# EAGLE design LabDuino (EAGLE 7.2.0)
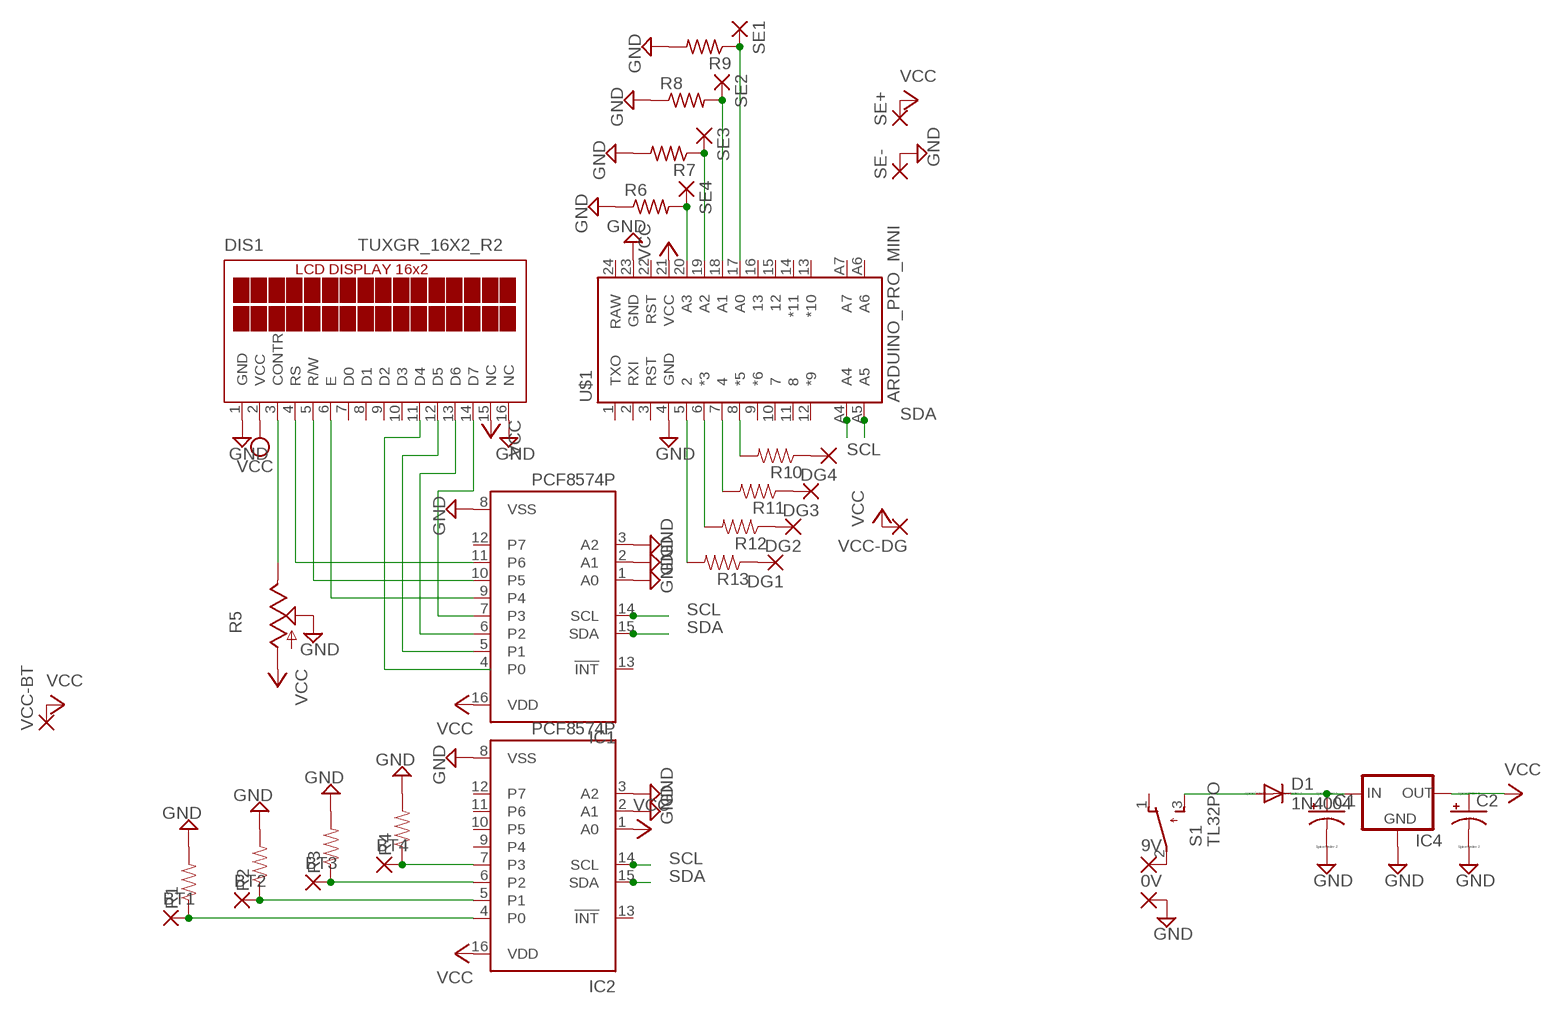
[diagram p0: schematic, sheet 1]

## Parts
0V  2,54/1,1  [2,54/1,1]
9V  2,54/1,1  [2,54/1,1]
BT1  1,6/0,9  [1,6/0,9]
BT2  1,6/0,9  [1,6/0,9]
BT3  1,6/0,9  [1,6/0,9]
BT4  1,6/0,9  [1,6/0,9]
C1  CPOL-USE2-4  [E2-4]
C2  CPOL-USE2-4  [E2-4]
D1  1N4004  [DO41-10]
DG1  1,6/0,9  [1,6/0,9]
DG2  1,6/0,9  [1,6/0,9]
DG3  1,6/0,9  [1,6/0,9]
DG4  1,6/0,9  [1,6/0,9]
DIS1  TUXGR_16X2_R2  [TUXGR_16X2_R2]
IC1  PCF8574P  [DIL16]
IC2  PCF8574P  [DIL16]
IC4  V_REG_78XX-TO-220  [TO-220-ALT]
R1  RESISTORPTH-1/6W  [1/6W-RES]
R2  RESISTORPTH-1/6W  [1/6W-RES]
R3  RESISTORPTH-1/6W  [1/6W-RES]
R4  RESISTORPTH-1/6W  [1/6W-RES]
R5  TRIM_US-B25P  [B25P]
R6  R-US_0204/7  [0204/7]
R7  R-US_0204/7  [0204/7]
R8  R-US_0204/7  [0204/7]
R9  R-US_0204/7  [0204/7]
R10  RESISTORPTH-1/6W  [1/6W-RES]
R11  RESISTORPTH-1/6W  [1/6W-RES]
R12  RESISTORPTH-1/6W  [1/6W-RES]
R13  RESISTORPTH-1/6W  [1/6W-RES]
S1  TL32PO  [TL3XPO]
SE1  1,6/0,9  [1,6/0,9]
SE2  1,6/0,9  [1,6/0,9]
SE3  1,6/0,9  [1,6/0,9]
SE4  1,6/0,9  [1,6/0,9]
SE+  1,6/0,9  [1,6/0,9]
SE-  1,6/0,9  [1,6/0,9]
U$1  ARDUINO_PRO_MINI  [ARDUINO_PRO_MINI]
VCC-BT  1,6/0,9  [1,6/0,9]
VCC-DG  1,6/0,9  [1,6/0,9]

## Nets
10K: BT2.1(P) IC2.5(P1) R2.1
GND: 0V.1(P) C1.- C2.- DIS1.1(GND) DIS1.16(NC) IC1.1(A0) IC1.2(A1) IC1.3(A2) IC1.8(VSS) IC2.2(A1) IC2.3(A2) IC2.8(VSS) IC4.GND R1.2 R2.2 R3.2 R4.2 R5.S R6.1 R7.2 R8.1 R9.2 SE-.1(P) U$1.4(GND) U$1.23(GND)
N$1: R6.2 SE4.1(P) U$1.20(A3)
N$2: BT1.1(P) IC2.4(P0) R1.1
N$3: 9V.1(P) S1.2(P)
N$4: BT3.1(P) IC2.6(P2) R3.1
N$5: BT4.1(P) IC2.7(P3) R4.1
N$6: R7.1 SE3.1(P) U$1.19(A2)
N$7: DIS1.4(RS) IC1.11(P6)
N$8: DIS1.5(R/W) IC1.10(P5)
N$9: DIS1.6(E) IC1.9(P4)
N$10: DIS1.14(D7) IC1.7(P3)
N$11: DIS1.13(D6) IC1.6(P2)
N$12: DIS1.12(D5) IC1.5(P1)
N$13: DIS1.11(D4)
N$14: DIS1.3(CONTR) R5.E
N$15: D1.A S1.3(S)
N$16: C1.+ D1.C IC4.IN
N$17: R8.2 SE2.1(P) U$1.18(A1)
N$18: R9.1 SE1.1(P) U$1.17(A0)
N$19: R13.2 U$1.5
N$20: R12.2 U$1.6(*3)
N$21: R11.2 U$1.7
N$22: R10.2 U$1.8(*5)
N$23: DG1.1(P) R13.1
N$24: DG2.1(P) R12.1
N$25: DG3.1(P) R11.1
N$26: DG4.1(P) R10.1
SCL: IC1.14(SCL) IC2.14(SCL) U$1.A4
SDA: IC1.15(SDA) IC2.15(SDA) U$1.A5
VCC: C2.+ DIS1.2(VCC) DIS1.15(NC) IC1.16(VDD) IC2.1(A0) IC2.16(VDD) IC4.OUT R5.A SE+.1(P) U$1.21(VCC) VCC-BT.1(P) VCC-DG.1(P)
Unconnected: DIS1.7(D0) DIS1.8(D1) DIS1.9(D2) DIS1.10(D3) IC1.4(P0) IC1.12(P7) IC1.13(!INT) IC2.9(P4) IC2.10(P5) IC2.11(P6) IC2.12(P7) IC2.13(!INT) S1.1(O) U$1.1(TXO) U$1.2(RXI) U$1.3(RST) U$1.9(*6) U$1.10 U$1.11 U$1.12(*9) U$1.13(*10) U$1.14(*11) U$1.15 U$1.16 U$1.22(RST) U$1.24(RAW) U$1.A6 U$1.A7

## Library data of the parts
0V 9V = wirepad:2,54/1,1: THROUGH-HOLE PAD
BT1-BT4 DG1-DG4 SE1-SE4 SE+ SE- VCC-BT VCC-DG = wirepad:1,6/0,9: THROUGH-HOLE PAD
C1 C2 = resistor:CPOL-US: POLARIZED CAPACITOR, American symbol
D1 = diode:1N4004: DIODE general purpose rectifier, 1 A
DIS1 = display-lcd:TUXGR_16X2_R2: Tuxgraphics LCD display 16x2 characters reflective, without background light Source: tuxgr_12x2_r2.pdf; OC_FARNELL: unknown; OC_NEWARK: unknown
IC1 IC2 = micro-philips:PCF8574: I2C-Bus Remote 8-bit I/O expander http://www.semiconductors.philips.com/acrobat_download/datasheets/PCF8574_4.pdf; MPN: PCF8574PN; OC_FARNELL: 204020; OC_NEWARK: 11N8515
IC4 = SparkFun-PowerIC:V_REG_78XX: Voltage Regulator Standard 78xx regulator. IGO (Input Ground Output). Spark Fun Electronics SKU : COM-00107
R1-R4 R10-R13 = SparkFun-Resistors:RESISTOR: Resistor Basic schematic elements and footprints for 0603, 1206, and PTH resistors.
R5 = pot:TRIM_US-: POTENTIOMETER
R6-R9 = resistor:R-US_: RESISTOR, American symbol
S1 = switch:TL32PO: TINY SWITCH ON - MOM Source: http://www2.produktinfo.conrad.com/datenblaetter/700000-724999/705152-da-01-de-Subminiaturschalter_TL_36YO.pdf
U$1 = SparkFun-Boards:ARDUINO_PRO_MINI

## Net classes
0 default: width 1.5 mm, drill 0.254 mm, clearance 2 mm

## Board
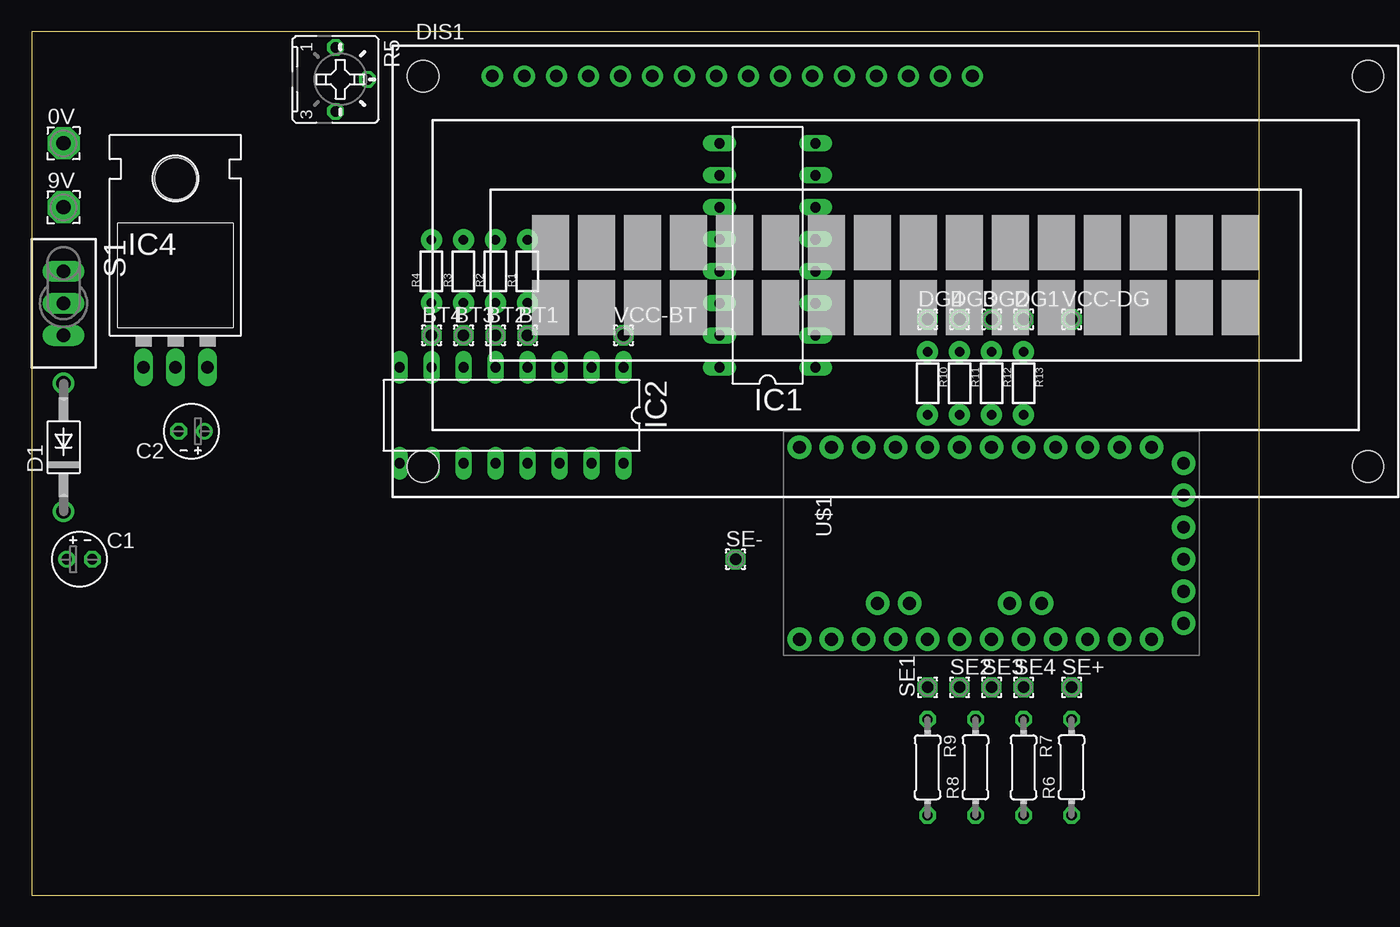
[diagram p1: board, top side]
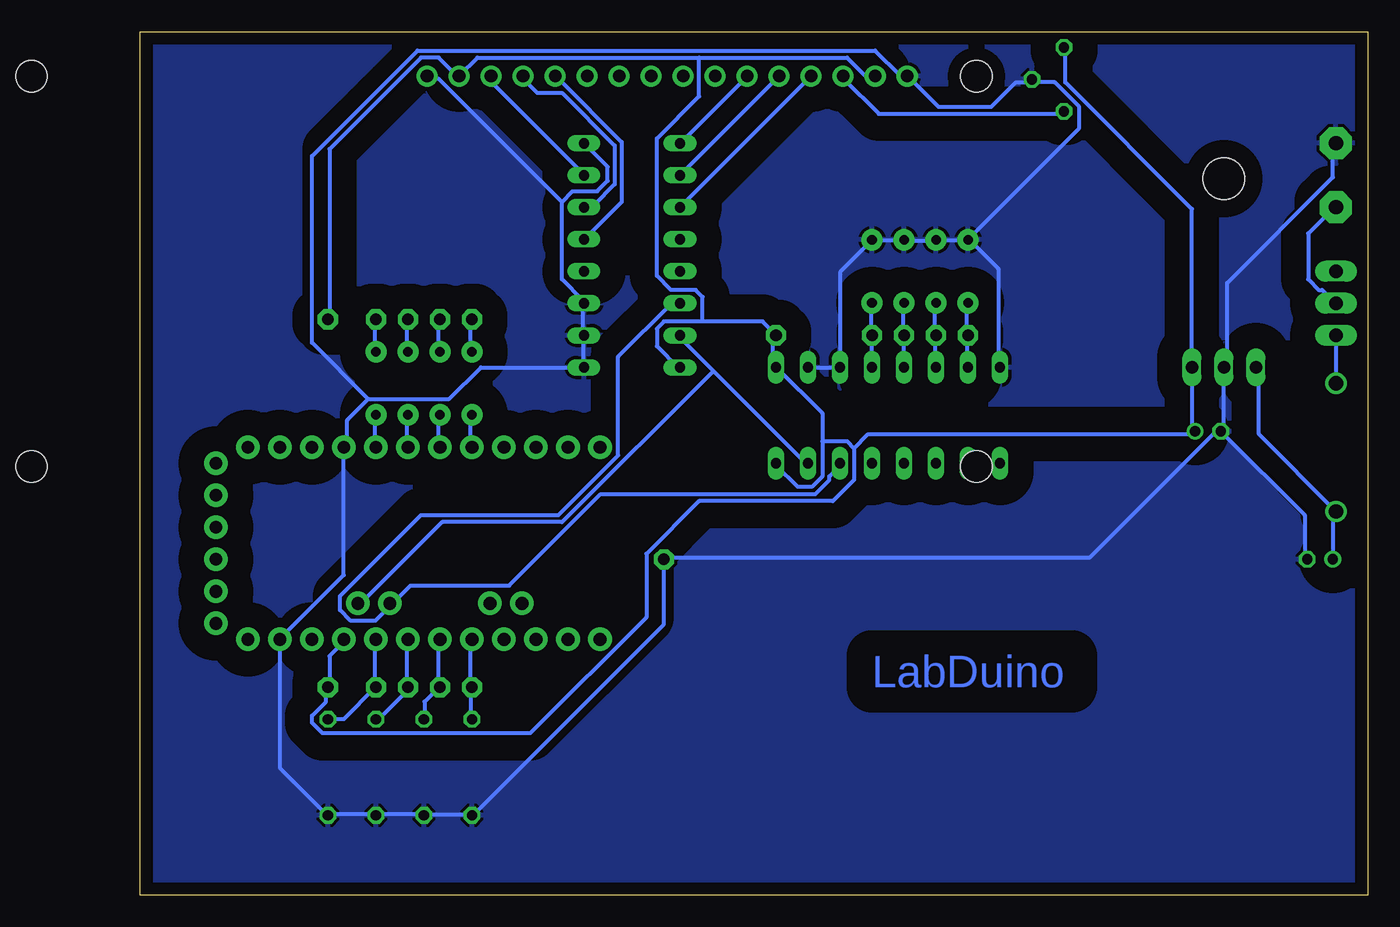
[diagram p2: board, bottom side, seen from below]

Size 97.46 x 68.57 mm. Coordinates in mm from the lower left corner, seen from the top.
Outline: 0,0 97.46,0 97.46,68.57 0,68.57 0,0
Copper layers (1*16): Top 0.035mm / dielectric 1.5mm / Bottom 0.035mm
Design rules "default": minimum track width 10mil, minimum drill 24mil, track to track 8mil, track to pad 8mil, pad to pad 8mil, via to via 8mil, smd to smd 8mil, copper to edge 40mil, drill to drill 8mil, minimum pad ring 10mil, minimum via ring 8mil, stop-mask expansion 4mil, vias tented up to drill 0mil, thermal gap 10mil

### Footprints (pad centres in the part's own frame; a part is rotated, then mirrored left to right if it is on the bottom)
2,54/1,1 = drill 1.118 pad 2.54 octagon: 1 0,0
1,6/0,9 = drill 0.914 pad 1.6 octagon: 1 0,0
E2-4 = drill 0.813 pad 1.27: + -1.016,0 | drill 0.813 pad 1.27 octagon: - 1.016,0
DO41-10 = drill 1.118: A 5.08,0; C -5.08,0
TUXGR_16X2_R2 = drill 1 pad 1.676: 1 -32,15.5; 2 -29.46,15.5; 3 -26.92,15.5; 4 -24.38,15.5; 5 -21.84,15.5; 6 -19.3,15.5; 7 -16.76,15.5; 8 -14.22,15.5; 9 -11.68,15.5; 10 -9.14,15.5; 11 -6.6,15.5; 12 -4.06,15.5; 13 -1.52,15.5; 14 1.02,15.5; 15 3.56,15.5; 16 6.1,15.5 | hole 2.5: -37.5,-15.5; 37.5,-15.5; -37.5,15.5; 37.5,15.5
DIL16 = drill 0.813 long: 1 -8.89,-3.81; 2 -6.35,-3.81; 3 -3.81,-3.81; 4 -1.27,-3.81; 5 1.27,-3.81; 6 3.81,-3.81; 7 6.35,-3.81; 8 8.89,-3.81; 9 8.89,3.81; 10 6.35,3.81; 11 3.81,3.81; 12 1.27,3.81; 13 -1.27,3.81; 14 -3.81,3.81; 15 -6.35,3.81; 16 -8.89,3.81
TO-220-ALT = drill 1.016 long: GND 0,-3.81; IN -2.54,-3.81; OUT 2.54,-3.81 | hole 3.302: 0,11.176
1/6W-RES = drill 0.762 pad 1.676: 1 -2.5,0; 2 2.5,0
B25P = drill 0.813 octagon: A -2.54,0; E 2.54,0; S 0,2.54
0204/7 = drill 0.813 octagon: 1 -3.81,0; 2 3.81,0
TL3XPO = drill 1.1 pad 1.422 long: 1 -2.54,0; 2 0,0; 3 2.54,0
ARDUINO_PRO_MINI = drill 1.016 pad 1.88: 1 -7.62,12.7; 2 -7.62,10.16; 3 -7.62,7.62; 4 -7.62,5.08; 5 -7.62,2.54; 6 -7.62,0; 7 -7.62,-2.54; 8 -7.62,-5.08; 9 -7.62,-7.62; 10 -7.62,-10.16; 11 -7.62,-12.7; 12 -7.62,-15.24; 13 7.62,-15.24; 14 7.62,-12.7; 15 7.62,-10.16; 16 7.62,-7.62; 17 7.62,-5.08; 18 7.62,-2.54; 19 7.62,0; 20 7.62,2.54; 21 7.62,5.08; 22 7.62,7.62; 23 7.62,10.16; 24 7.62,12.7; A4 4.763,1.429; A5 4.763,3.969; A6 4.763,-9.049; A7 4.763,-6.509; BLK -6.35,15.24; GND -3.81,15.24; GRN 6.35,15.24; RXI 1.27,15.24; TXO 3.81,15.24; VCC -1.27,15.24

### Placement (x,y rotation side)
0V  2.54,59.69 0 top
9V  2.54,54.61 0 top
BT1  39.37,44.45 0 top
BT2  36.83,44.45 0 top
BT3  34.29,44.45 0 top
BT4  31.75,44.45 0 top
C1  3.81,26.67 0 top
C2  12.7,36.83 180 top
D1  2.54,35.56 90 top
DG1  78.74,45.72 0 top
DG2  76.2,45.72 0 top
DG3  73.66,45.72 0 top
DG4  71.12,45.72 0 top
DIS1  68.58,49.53 0 top
IC1  58.42,50.8 90 top
IC2  38.1,38.1 180 top
IC4  11.43,45.72 0 top
R1  39.37,49.53 90 top
R2  36.83,49.53 90 top
R3  34.29,49.53 90 top
R4  31.75,49.53 90 top
R5  24.13,64.77 270 top
R6  82.55,10.16 90 top
R7  78.74,10.16 270 top
R8  74.93,10.16 90 top
R9  71.12,10.16 270 top
R10  71.12,40.64 270 top
R11  73.66,40.64 270 top
R12  76.2,40.64 270 top
R13  78.74,40.64 270 top
S1  2.54,46.99 270 top
SE1  71.12,16.51 90 top
SE2  73.66,16.51 0 top
SE3  76.2,16.51 0 top
SE4  78.74,16.51 0 top
SE+  82.55,16.51 0 top
SE-  55.88,26.67 0 top
U$1  76.2,27.94 270 top
VCC-BT  46.99,44.45 0 top
VCC-DG  82.55,45.72 0 top

### Tracks (layer width: path | path; a pad name or v marks a point on that pad's centre or on a via)
10K
  Bottom 0.305: IC2.5 36.88,41.91 36.88,44.42 BT2.1 36.88,44.7 36.88,46.94 R2.1
GND
  Bottom 0.305: C2.- 5.03,30.18 5.03,26.82 C1.- | C2.- 11.46,36.88 11.46,41.91 IC4.GND 11.18,41.91 11.18,48.62 2.79,57 2.79,59.51 0V.1 | IC2.2 IC2.3 41.91,49.45 39.4,51.97 R1.2 39.12,51.97 36.88,51.97 R2.2 36.6,51.97 34.37,51.97 R3.2 34.09,51.97 31.85,51.97 R4.2 | IC2.8 29.34,41.91 29.34,49.73 31.57,51.97 R4.2 | R4.2 31.57,52.25 22.91,60.91 22.91,62.59 24.87,64.54 26.54,64.54 R5.S 26.82,64.54 27.94,64.54 29.9,62.59 34.09,62.59 36.32,64.82 DIS1.1 36.6,65.1 37.16,65.1 39.12,67.06 75.44,67.06 83.82,58.67 83.82,43.87 79.35,39.4 | 62.31,41.91 62.31,44.42 IC1.2 62.31,44.7 62.31,46.94 IC1.3 62.31,47.22 63.98,48.9 63.98,55.04 | 63.98,55.04 63.14,55.88 61.19,55.88 60.35,56.72 60.35,57.84 62.03,59.51 IC1.8 | 63.98,55.04 73.76,64.82 74.6,64.82 DIS1.16 | 62.31,41.91 70.41,41.91 72.92,39.4 79.35,39.4 | 79.35,39.4 81.03,37.72 81.03,35.76 U$1.4 81.31,35.48 81.31,25.43 86.33,20.4 U$1.23 86.33,20.12 86.33,10.06 82.7,6.43 R6.1 82.42,6.43 78.79,6.43 R7.2 78.51,6.43 75.16,6.43 R8.1 74.88,6.43 71.25,6.43 R9.2 70.97,6.43 55.88,21.51 SE-.1 55.88,26.82 22.07,26.82 12.29,36.6 11.73,36.6 C2.- | 62.31,41.91 IC1.1
  pour Bottom: -1.27,69.85 -1.27,-1.27 99.06,-1.27 99.06,69.85
N$1
  Bottom 0.305: R6.2 81.31,13.97 78.79,16.48 SE4.1 78.79,16.76 78.79,20.12 U$1.20
N$2
  Bottom 0.305: IC2.4 39.4,41.91 39.4,44.42 BT1.1 39.4,44.7 39.4,46.94 R1.1
N$3
  Bottom 0.305: S1.2 2.79,47.22 3.63,48.06 3.91,48.06 4.75,48.9 4.75,52.53 2.79,54.48 9V.1
N$4
  Bottom 0.305: IC2.6 34.37,41.91 34.37,44.42 BT3.1 34.37,44.7 34.37,46.94 R3.1
N$5
  Bottom 0.305: IC2.7 31.85,41.91 31.85,44.42 BT4.1 31.85,44.7 31.85,46.94 R4.1
N$6
  Bottom 0.305: R7.1 78.51,13.97 76,16.48 SE3.1 76.28,16.76 76.28,20.12 U$1.19
N$7
  Bottom 0.305: IC1.11 54.48,54.76 44.42,64.82 DIS1.4
N$8
  Bottom 0.305: IC1.10 46.94,64.82 DIS1.5
N$9
  Bottom 0.305: IC1.9 54.48,59.79 49.45,64.82 DIS1.6
N$10
  Bottom 0.305: IC1.7 62.31,57.28 69.85,64.82 DIS1.14
N$11
  Bottom 0.305: IC1.6 62.03,54.76 61.47,54.76 59.79,56.44 59.79,59.51 63.98,63.7 65.94,63.7 67.06,64.82 DIS1.13
N$12
  Bottom 0.305: IC1.5 62.03,52.25 59.23,55.04 59.23,59.79 64.26,64.82 DIS1.12
N$14
  Bottom 0.305: R5.E 24.31,62.03 38.84,62.03 41.63,64.82 DIS1.3
N$15
  Bottom 0.305: S1.3 2.52,44.42 2.52,40.79 D1.A
N$16
  Bottom 0.305: C1.+ 2.79,30.45 D1.C 8.66,36.6 8.66,41.91 IC4.IN
N$17
  Bottom 0.305: R8.2 74.88,13.97 74.88,15.37 73.76,16.48 SE2.1 73.76,16.76 73.76,20.12 U$1.18
N$18
  Bottom 0.305: R9.1 71.25,13.97 71.25,16.48 SE1.1 71.25,16.76 71.25,20.12 U$1.17
N$19
  Bottom 0.305: R13.2 78.79,38 78.79,35.76 U$1.5
N$20
  Bottom 0.305: R12.2 76.28,38 76.28,35.76 U$1.6
N$21
  Bottom 0.305: R11.2 73.76,38 73.76,35.76 U$1.7
N$22
  Bottom 0.305: R10.2 71.25,38 71.25,35.76 U$1.8
N$23
  Bottom 0.305: DG1.1 78.79,45.54 78.79,43.31 R13.1
N$24
  Bottom 0.305: DG2.1 76.28,45.54 76.28,43.31 R12.1
N$25
  Bottom 0.305: DG3.1 73.76,45.54 73.76,43.31 R11.1
N$26
  Bottom 0.305: DG4.1 71.25,45.54 71.25,43.31 R10.1
SCL
  Bottom 0.305: IC2.14 41.91,34.09 42.75,33.25 42.75,32.97 43.87,31.85 60.91,31.85 68.17,24.59 76,24.59 77.39,23.19 U$1.A4 77.67,22.91 78.79,21.79 80.75,21.79 81.58,22.63 81.58,23.75 75.16,30.18 64.26,30.18 59.51,34.92 59.51,42.75 55.32,46.94 54.76,46.94 IC1.14
SDA
  Bottom 0.305: 51.97,41.63 54.76,44.42 IC1.15 | 51.97,41.63 44.7,34.37 IC2.15 | 51.97,41.63 63.98,29.62 73.48,29.62 79.91,23.19 U$1.A5
VCC
  Bottom 0.305: VCC-DG.1 82.42,45.82 82.42,59.23 75.16,66.5 73.76,66.5 72.36,65.1 DIS1.15 72.08,65.1 70.69,66.5 53.09,66.5 | 53.09,66.5 41.35,66.5 39.95,65.1 39.4,65.1 DIS1.2 | R5.A 24.03,67.06 24.03,64.54 13.97,54.48 IC4.OUT 13.97,36.88 C2.+ 13.97,36.6 39.67,36.6 40.79,35.48 | 52.81,45.54 48.06,45.54 47.22,44.7 VCC-BT.1 47.22,44.42 47.22,41.91 IC2.1 46.94,41.91 43.31,38.28 43.31,36.04 | 52.81,45.54 55.88,45.54 56.44,44.98 56.44,43.59 54.76,41.91 IC1.16 | U$1.21 81.31,20.12 82.42,19 82.42,16.76 SE+.1 82.7,16.48 82.7,15.37 83.82,14.25 83.82,13.69 82.98,12.85 66.5,12.85 57.28,22.07 57.28,27.1 53.09,31.29 42.47,31.29 40.79,32.97 40.79,35.48 | 43.31,36.04 43.31,33.25 44.15,32.41 45.26,32.41 46.94,34.09 IC2.16 | 40.79,35.48 41.35,36.04 43.31,36.04 | 53.09,66.5 53.09,63.42 56.44,60.07 56.44,49.17 55.32,48.06 53.37,48.06 52.81,47.5 52.81,45.54

### Text on the board
Bottom: LabDuino